# Altium project HEAD_HEATER_CTRL_2CH.PrjPcb
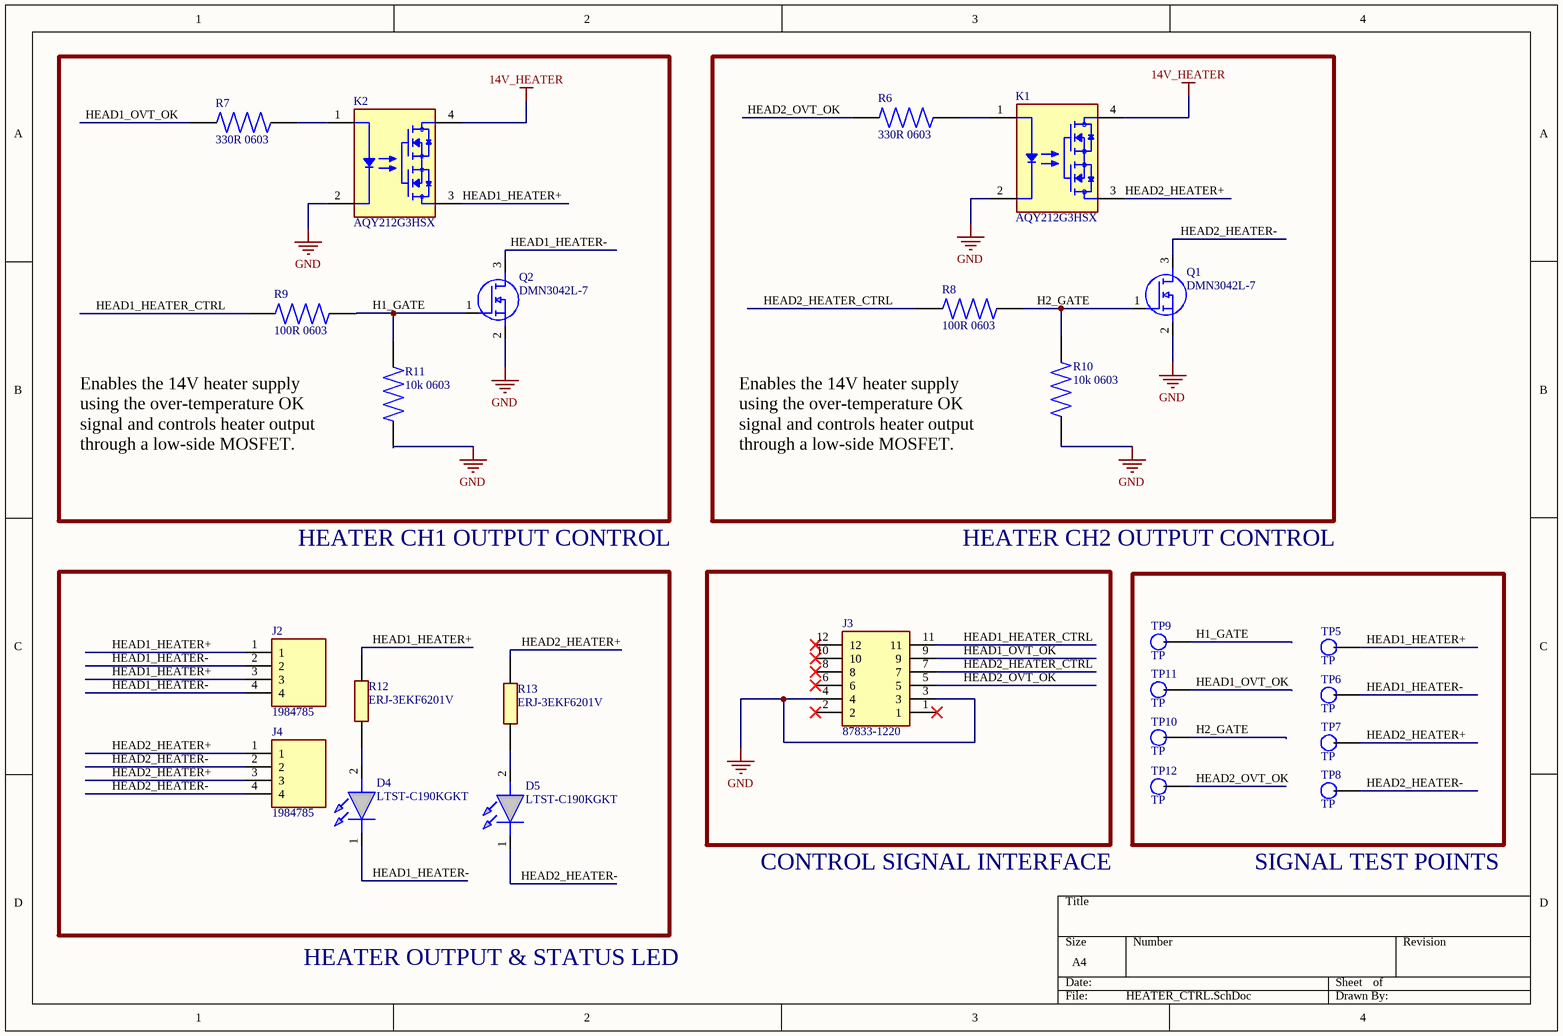
[diagram p0: HEATER_CTRL.SchDoc]
1 sheet, 25 parts. Net scope: global (net labels, ports and power ports of the same name join across sheets).
Board file: HEAD_HEATER_CTRL_2CH.PcbDoc

## Sheet HEATER_CTRL.SchDoc
size A4; SheetNumber: 2; SheetTotal: 2

### Parts
D4  LTST-C190KGKT  [LEDC1608X80N]
D5  LTST-C190KGKT  [LEDC1608X80N]
J2  1984785  [1984785]
J3  87833-1220  [SHDRRA12W55P200_2X6_1465X640X630P]
J4  1984785  [1984785]
K1  AQY212G3HSX  [SOIC254P680X230-4N]
K2  AQY212G3HSX  [SOIC254P680X230-4N]
Q1  DMN3042L-7  [SOT96P240X115-3N]
Q2  DMN3042L-7  [SOT96P240X115-3N]
R6  330R 0603  [RES_ERJ3EKF3300V]
R7  330R 0603  [RES_ERJ3EKF3300V]
R8  100R 0603  [RES_ERJ3EKF1000V]
R9  100R 0603  [RES_ERJ3EKF1000V]
R10  10k 0603  [RES_ERJ3EKF1002V]
R11  10k 0603  [RES_ERJ3EKF1002V]
R12  ERJ-3EKF6201V  [RESC1608X55N]
R13  ERJ-3EKF6201V  [RESC1608X55N]
TP5  TP  [TESTPOINT]
TP6  TP  [TESTPOINT]
TP7  TP  [TESTPOINT]
TP8  TP  [TESTPOINT]
TP9  TP  [TESTPOINT]
TP10  TP  [TESTPOINT]
TP11  TP  [TESTPOINT]
TP12  TP  [TESTPOINT]

### Nets
14V_HEATER: K1.4 K2.4
GND: J3.3 J3.4 K1.2 K2.2 Q1.2(S) Q2.2(S) R10.1 R11.1
H1_GATE: Q2.1(G) R9.2 R11.2 TP9.1
H2_GATE: Q1.1(G) R8.2 R10.2 TP10.1
HEAD1_HEATER+: J2.1 J2.3 K2.3 R12.2 TP5.1
HEAD1_HEATER-: D4.1(K) J2.2 J2.4 Q2.3(D) TP6.1
HEAD1_HEATER_CTRL: J3.11 R9.1
HEAD1_OVT_OK: J3.9 R7.1 TP11.1
HEAD2_HEATER+: J4.1 J4.3 K1.3 R13.2 TP7.1
HEAD2_HEATER-: D5.1(K) J4.2 J4.4 Q1.3(D) TP8.1
HEAD2_HEATER_CTRL: J3.7 R8.1
HEAD2_OVT_OK: J3.5 R6.1 TP12.1
NetD4_2: D4.2(A) R12.1
NetD5_2: D5.2(A) R13.1
NetK1_1: K1.1 R6.2
NetK2_1: K2.1 R7.2

Not connected (* = marked no-connect by the designer): J3 1* 2* 6* 8* 10* 12*

### Notes on the sheet
- Enables the 14V heater supply using the over-temperature OK signal and controls heater output through a low-side MOSFET.
- HEATER CH1 OUTPUT CONTROL
- HEATER CH2 OUTPUT CONTROL
- CONTROL SIGNAL INTERFACE
- SIGNAL TEST POINTS
- HEATER OUTPUT & STATUS LED

### Library data of the parts
D4 D5 = LTST-C190KGKT: Lite-On LTST-C190KGKT, 571 nm Green LED, 1608 (0603) SMD package; Geometry.Height: 0.8mm; Mouser Part Number: 859-LTST-C190KGKT; Mouser Price/Stock: https://www.mouser.co.uk/ProductDetail/Lite-On/LTST-C190KGKT?qs=205qCy6M2Q%252BAdcgwUZktqw%3D%3D; Manufacturer_Name: Lite-On; Manufacturer_Part_Number: LTST-C190KGKT; Datasheet Link: *
J2 J4 = 1984785: PT 1,5/ 4-3,5-V - Printed circuit board terminal, nominal current: 17.5 A, rated voltage (III/2): 200 V, nominal cross section: 1.5 mm<sup>2</sup>, number of potentials: 4, number of rows: 1, number of positions per row: 4, product range: PT 1,5/..-V, pitch: 3.5 mm, connection method: Screw connection with wire protector, screw head form: H1L Slotted Phillips recess, mounting: Wave soldering, conductor/PCB connection direction: 90 , color: green, Pin layout: Linear pinning, Solder pin [P]: 4.5 mm, number o; Manufacturer_Name: Phoenix Contact; Geometry.Height: 7.7mm; Mouser Part Number: 651-1984785; Mouser Price/Stock: https://www.mouser.co.uk/ProductDetail/Phoenix-Contact/1984785?qs=MCbhYIqTEtldDub9XDF2qg%3D%3D; Manufacturer_Part_Number: 1984785; Datasheet Link: https://www.phoenixcontact.com/en-us/products/printed-circuit-board-terminal-pt-15-4-35-v-1984785?type=pdf
J3 = 87833-1220: MOLEX - 87833-1220 - HEADER, MILLI-GRID, 2MM, THD, R/A, 12WAY; Geometry.Height: 6.3mm; Manufacturer_Name: Molex; Manufacturer_Part_Number: 87833-1220; Mouser Part Number: 538-87833-1220; Mouser Price/Stock: https://www.mouser.co.uk/ProductDetail/Molex/87833-1220?qs=%252Bv5WsHscnfddNjhKFKm4rw%3D%3D; Arrow Part Number: *; Arrow Price/Stock: *; Datasheet Link: https://www.molex.com/pdm_docs/sd/878331220_sd.pdf
K1 K2 = AQY212G3HSX: Solid State Photo-Coupled Relay (Photorelay) SPST-NO (1 Form A) 4-SMD, Gull Wing; MF: Panasonic; SnapEDA_Link: https://www.snapeda.com/parts/AQY212G3HSX/Panasonic/view-part/?ref=snap; Package: None; Value: *; MP: AQY212G3HSX; Check_prices: https://www.snapeda.com/parts/AQY212G3HSX/Panasonic/view-part/?ref=eda
Q1 Q2 = DMN3042L-7: MOSFET 30V N-Ch Enh Mode 26.5mOhm 10V 5.8A; Manufacturer_Name: Diodes Incorporated; Geometry.Height: 1.15mm; Mouser Part Number: 621-DMN3042L-7; Mouser Price/Stock: https://www.mouser.co.uk/ProductDetail/Diodes-Incorporated/DMN3042L-7?qs=BvpHGKeVh3rQK2Uscu7jEw%3D%3D; Manufacturer_Part_Number: DMN3042L-7; Datasheet Link: https://www.diodes.com//assets/Datasheets/DMN3042L.pdf
R6 R7 = ERJ3EKF3300V: Res Thick Film 0603 330 Ohm 1% 0.1W(1/10W) 100ppm/C Molded SMD Punched Carrier T/R; MF: Panasonic; MP: ERJ-3EKF3300V; SnapEDA_Link: https://www.snapeda.com/parts/ERJ-3EKF3300V/Panasonic+Electronic+Components/view-part/?ref=snap; Package: 1608-2 Panasonic; Value: *; Check_prices: https://www.snapeda.com/parts/ERJ-3EKF3300V/Panasonic+Electronic+Components/view-part/?ref=eda
R8 R9 = ERJ3EKF1000V: 100 Ohms 1% 0.1W, 1/10W Chip Resistor 0603 (1608 Metric) Automotive AEC-Q200 Thick Film; MF: Panasonic; MP: ERJ-3EKF1000V; SnapEDA_Link: https://www.snapeda.com/parts/ERJ-3EKF1000V/Panasonic+Electronic+Components/view-part/?ref=snap; Package: 1608-2 Panasonic; Value: *; Check_prices: https://www.snapeda.com/parts/ERJ-3EKF1000V/Panasonic+Electronic+Components/view-part/?ref=eda
R10 R11 = ERJ3EKF1002V: 10 kOhms 1% 0.1W, 1/10W Chip Resistor 0603 (1608 Metric) Automotive AEC-Q200 Thick Film; MF: Panasonic; MP: ERJ-3EKF1002V; SnapEDA_Link: https://www.snapeda.com/parts/ERJ-3EKF1002V/Panasonic+Electronic+Components/view-part/?ref=snap; Package: 1608-2 Panasonic; Value: *; Check_prices: https://www.snapeda.com/parts/ERJ-3EKF1002V/Panasonic+Electronic+Components/view-part/?ref=eda
R12 R13 = ERJ-3EKF6201V: Precision Thick Film Chip Resistor, 0603, 0.1W; Manufacturer_Name: Panasonic; Geometry.Height: 0.55mm; Mouser Part Number: 667-ERJ-3EKF6201V; Mouser Price/Stock: https://www.mouser.co.uk/ProductDetail/Panasonic/ERJ-3EKF6201V?qs=iBwFsHVUAOd2VkgAcHpNRw%3D%3D; Manufacturer_Part_Number: ERJ-3EKF6201V; Datasheet Link: http://industrial.panasonic.com/cdbs/www-data/pdf/RDA0000/AOA0000C86.pdf